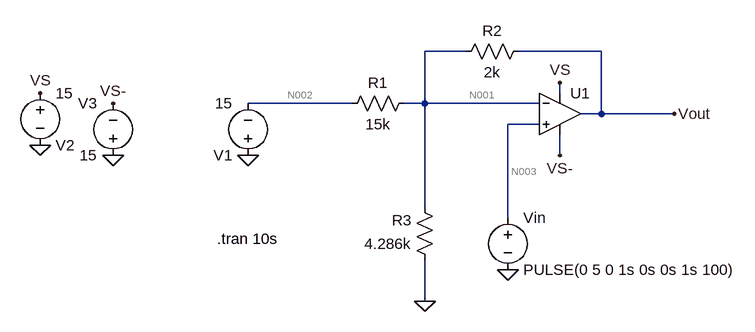
[diagram p0: schematic transformacion lineal.asc]
transformacion lineal.asc, the LTspice schematic file:
Version 4
SHEET 1 1060 680
WIRE 240 32 176 32
WIRE 448 32 320 32
WIRE 384 96 384 80
WIRE 64 112 -96 112
WIRE 176 112 176 32
WIRE 176 112 144 112
WIRE 352 112 176 112
WIRE 448 128 448 32
WIRE 448 128 416 128
WIRE 560 128 448 128
WIRE 352 144 304 144
WIRE 384 192 384 160
WIRE 176 272 176 112
WIRE 304 288 304 144
WIRE 176 416 176 352
FLAG 176 416 0
FLAG -96 192 0
FLAG 384 80 VS
FLAG 304 368 0
FLAG -304 192 0
FLAG -304 112 VS-
FLAG 384 192 VS-
FLAG 560 128 Vout
FLAG -416 176 0
FLAG -416 96 VS
SYMBOL res 160 96 R90
WINDOW 0 0 56 VBottom 2
WINDOW 3 32 56 VTop 2
SYMATTR InstName R1
SYMATTR Value 15k
SYMBOL res 192 368 R180
WINDOW 0 36 76 Left 2
WINDOW 3 36 40 Left 2
SYMATTR InstName R3
SYMATTR Value 4.286k
SYMBOL res 224 48 R270
WINDOW 0 32 56 VTop 2
WINDOW 3 0 56 VBottom 2
SYMATTR InstName R2
SYMATTR Value 2k
SYMBOL voltage -96 208 R180
WINDOW 123 0 0 Left 2
WINDOW 39 0 0 Left 2
SYMATTR InstName V1
SYMATTR Value 15
SYMBOL voltage 304 272 R0
WINDOW 123 0 0 Left 2
WINDOW 39 0 0 Left 2
SYMATTR InstName Vin
SYMATTR Value PULSE(0 5 0 1s 0s 0s 1s 100)
SYMBOL voltage -304 208 R180
WINDOW 0 24 96 Left 2
WINDOW 3 24 16 Left 2
WINDOW 123 0 0 Left 2
WINDOW 39 0 0 Left 2
SYMATTR InstName V3
SYMATTR Value 15
SYMBOL Opamps\\UniversalOpamp2 384 128 R0
SYMATTR InstName U1
SYMBOL voltage -416 80 R0
WINDOW 0 24 96 Left 2
WINDOW 3 24 16 Left 2
WINDOW 123 0 0 Left 2
WINDOW 39 0 0 Left 2
SYMATTR InstName V2
SYMATTR Value 15
TEXT -144 320 Left 2 !.tran 10s

The netlist it stands for:
* transformacion lineal.asc
R1 N001 N002 15k
R3 0 N001 4.286k
R2 N001 Vout 2k
V1 0 N002 15
Vin N003 0 PULSE(0 5 0 1s 0s 0s 1s 100)
V3 0 VS- 15
XU1 N003 N001 VS VS- Vout level.2 Avol=1Meg GBW=10Meg Slew=10Meg ilimit=25m rail=0 Vos=0 phimargin=45 en=0 enk=0 in=0 ink=0 Rin=500Meg  ; pins IN+ IN- V+ V- OUT
V2 VS 0 15
.tran 10s
.lib UniversalOpamps2.sub
.backanno
.end

* Results of the author's LTspice run, read from the files saved beside the schematic
* Operating Point, zero values left out:
*   V(n001) = -2.011 µV
*   V(n002) = -15 V
*   V(vout) = 2 V
*   V(vs-) = -15 V
*   V(vs) = 15 V
*   I(R2) = -1 mA
*   I(R3) = 469.2 pA
*   I(R1) = 1 mA
*   I(V2) = -2.066 mA
*   I(V3) = -1.067 mA
*   I(V1) = -1 mA
*   Ix(u1:3) = 2.066 mA
*   Ix(u1:4) = -1.067 mA
*   Ix(u1:5) = -1 mA
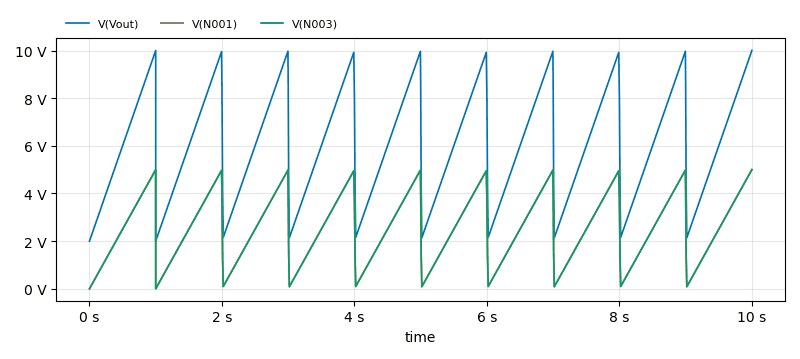
[diagram p1: Transient Analysis of transformacion lineal.asc, plotted from the saved traces]
* Transient Analysis, 1 run:
*   V(Vout): min 2 V, max 10.01 V, average 6.034 V, rms 6.64 V, last 10.01 V
*   V(N001): min -2.011 µV, max 5.004 V, average 2.521 V, rms 3.059 V, last 5.004 V
*   V(N003): min 0 V, max 5 V, average 2.521 V, rms 3.059 V, last 5 V